# EAGLE design piston_slave (EAGLE 9.5.1)
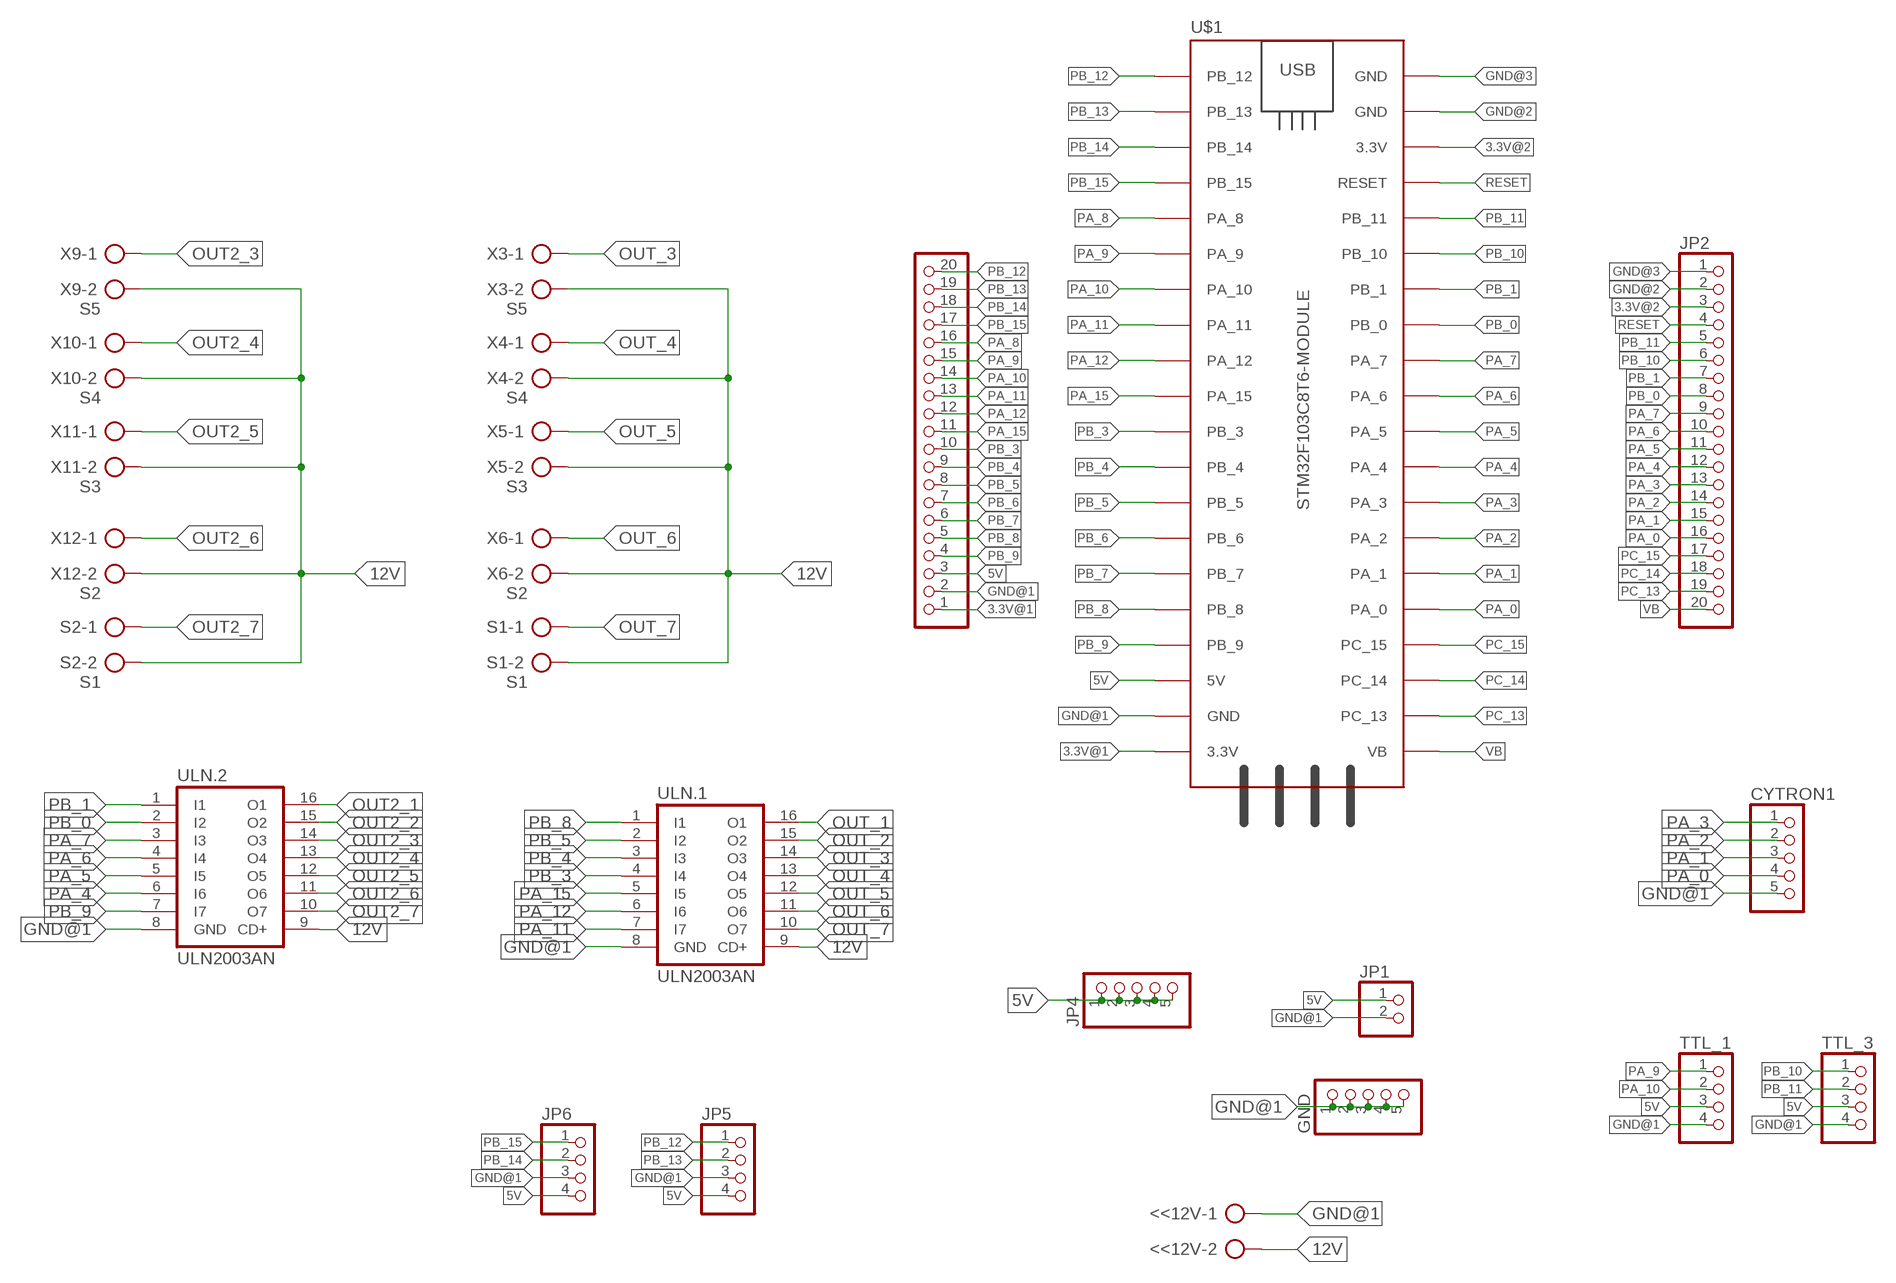
[diagram p0: schematic, sheet 1]

## Parts
<<12V  AK300/2  [AK300/2]
CYTRON1  PINHD-5_DATA  [DATA_5]
GND  PINHD-1X5  [1X05]
JP1  PINHD-2_DATA  [1X02_DATA]
JP2  PINHD-1X20  [1X20]
JP3  PINHD-1X20  [1X20]
JP4  PINHD-1X5  [1X05]
JP5  PINHD-4_DATA  [1X04_DATA]
JP6  PINHD-4_DATA  [1X04_DATA]
S1  S1  AK300/2  [AK300/2]
S2  S1  AK300/2  [AK300/2]
TTL_1  PINHD-4_DATA  [1X04_DATA]
TTL_3  PINHD-4_DATA  [1X04_DATA]
U$1  STM32F103C8T6-MODULE  [STM32F103C8T6-MODULE]
ULN.1  ULN2003AN  [DIL16]
ULN.2  ULN2003AN  [DIL16]
X3  S5  AK300/2  [AK300/2]
X4  S4  AK300/2  [AK300/2]
X5  S3  AK300/2  [AK300/2]
X6  S2  AK300/2  [AK300/2]
X9  S5  AK300/2  [AK300/2]
X10  S4  AK300/2  [AK300/2]
X11  S3  AK300/2  [AK300/2]
X12  S2  AK300/2  [AK300/2]

## Nets
3.3V@1: JP3.1 U$1.3.3V_1(3.3V)
3.3V@2: JP2.3 U$1.3.3V_2(3.3V)
5V: JP1.1 JP3.3 JP4.1 JP4.2 JP4.3 JP4.4 JP4.5 JP5.4 JP6.4 TTL_1.3 TTL_3.3 U$1.5V
12V: <<12V.2 S1.2 S2.2 ULN.1.9(CD+) ULN.2.9(CD+) X3.2 X4.2 X5.2 X6.2 X9.2 X10.2 X11.2 X12.2
GND@1: <<12V.1 CYTRON1.5 GND.1 GND.2 GND.3 GND.4 GND.5 JP1.2 JP3.2 JP5.3 JP6.3 TTL_1.4 TTL_3.4 U$1.GND_1(GND) ULN.1.8(GND) ULN.2.8(GND)
GND@2: JP2.2 U$1.GND_2(GND)
GND@3: JP2.1 U$1.GND_3(GND)
OUT2_1: ULN.2.16(O1)
OUT2_2: ULN.2.15(O2)
OUT2_3: ULN.2.14(O3) X9.1
OUT2_4: ULN.2.13(O4) X10.1
OUT2_5: ULN.2.12(O5) X11.1
OUT2_6: ULN.2.11(O6) X12.1
OUT2_7: S2.1 ULN.2.10(O7)
OUT_1: ULN.1.16(O1)
OUT_2: ULN.1.15(O2)
OUT_3: ULN.1.14(O3) X3.1
OUT_4: ULN.1.13(O4) X4.1
OUT_5: ULN.1.12(O5) X5.1
OUT_6: ULN.1.11(O6) X6.1
OUT_7: S1.1 ULN.1.10(O7)
PA_0: CYTRON1.4 JP2.16 U$1.PA_0
PA_1: CYTRON1.3 JP2.15 U$1.PA_1
PA_2: CYTRON1.2 JP2.14 U$1.PA_2
PA_3: CYTRON1.1 JP2.13 U$1.PA_3
PA_4: JP2.12 U$1.PA_4 ULN.2.6(I6)
PA_5: JP2.11 U$1.PA_5 ULN.2.5(I5)
PA_6: JP2.10 U$1.PA_6 ULN.2.4(I4)
PA_7: JP2.9 U$1.PA_7 ULN.2.3(I3)
PA_8: JP3.16 U$1.PA_8
PA_9: JP3.15 TTL_1.1 U$1.PA_9
PA_10: JP3.14 TTL_1.2 U$1.PA_10
PA_11: JP3.13 U$1.PA_11 ULN.1.7(I7)
PA_12: JP3.12 U$1.PA_12 ULN.1.6(I6)
PA_15: JP3.11 U$1.PA_15 ULN.1.5(I5)
PB_0: JP2.8 U$1.PB_0 ULN.2.2(I2)
PB_1: JP2.7 U$1.PB_1 ULN.2.1(I1)
PB_3: JP3.10 U$1.PB_3 ULN.1.4(I4)
PB_4: JP3.9 U$1.PB_4 ULN.1.3(I3)
PB_5: JP3.8 U$1.PB_5 ULN.1.2(I2)
PB_6: JP3.7 U$1.PB_6
PB_7: JP3.6 U$1.PB_7
PB_8: JP3.5 U$1.PB_8 ULN.1.1(I1)
PB_9: JP3.4 U$1.PB_9 ULN.2.7(I7)
PB_10: JP2.6 TTL_3.1 U$1.PB_10
PB_11: JP2.5 TTL_3.2 U$1.PB_11
PB_12: JP3.20 JP5.1 U$1.PB_12
PB_13: JP3.19 JP5.2 U$1.PB_13
PB_14: JP3.18 JP6.2 U$1.PB_14
PB_15: JP3.17 JP6.1 U$1.PB_15
PC_13: JP2.19 U$1.PC_13
PC_14: JP2.18 U$1.PC_14
PC_15: JP2.17 U$1.PC_15
RESET: JP2.4 U$1.RESET
VB: JP2.20 U$1.VB

## Library data of the parts
<<12V S1 S2 X3-X6 X9-X12 = con-ptr500:AK300/2: CONNECTOR; OC_FARNELL: unknown; OC_NEWARK: unknown
CYTRON1 = MIA_LIBRARY:PINHD-5_DATA: PIN HEADER
GND JP4 = MIA_LIBRARY:PINHD-1X5: PIN HEADER
JP1 = MIA_LIBRARY-2-2-2:PINHD-2_DATA: PIN HEADER
JP2 JP3 = pinhead:PINHD-1X20: PIN HEADER
JP5 JP6 TTL_1 TTL_3 = MIA_LIBRARY-2-2-2:PINHD-4_DATA: PIN HEADER
U$1 = MIA_LIBRARY:STM32F103C8T6-MODULE: STM32F103C8T6 module with ARM Cortex-3, 20kB SRAM, 64kB Flash, 72MHz
ULN.1 ULN.2 = MIA_LIBRARY:ULN2003A: DRIVER ARRAY

## Board
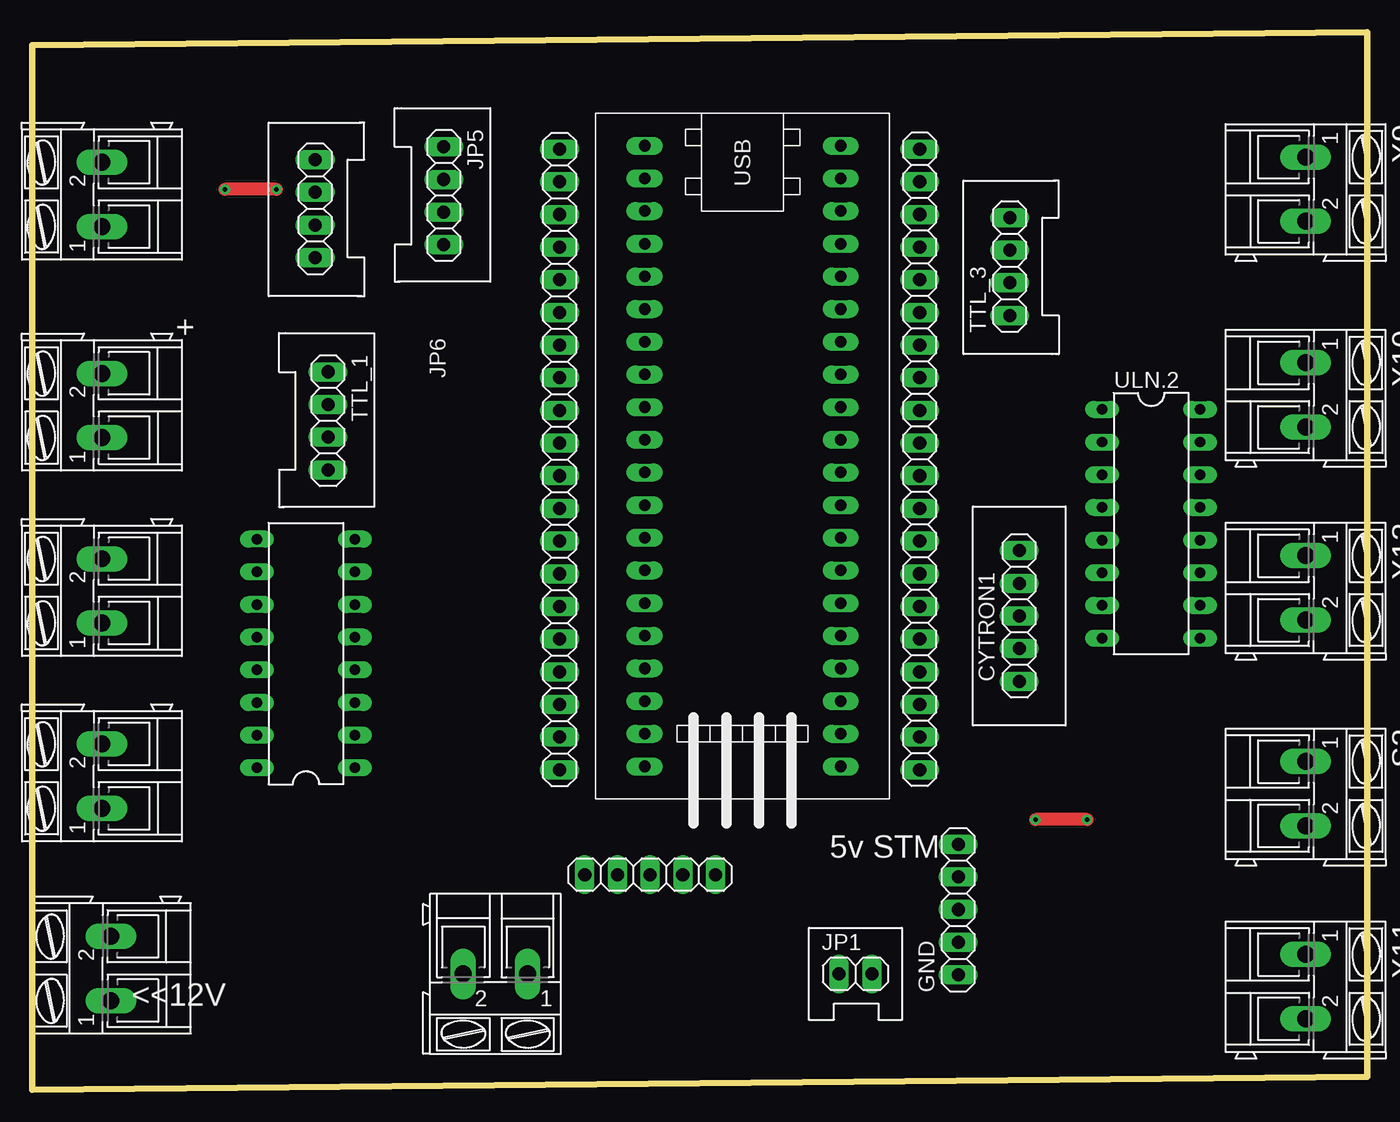
[diagram p1: board, top side]
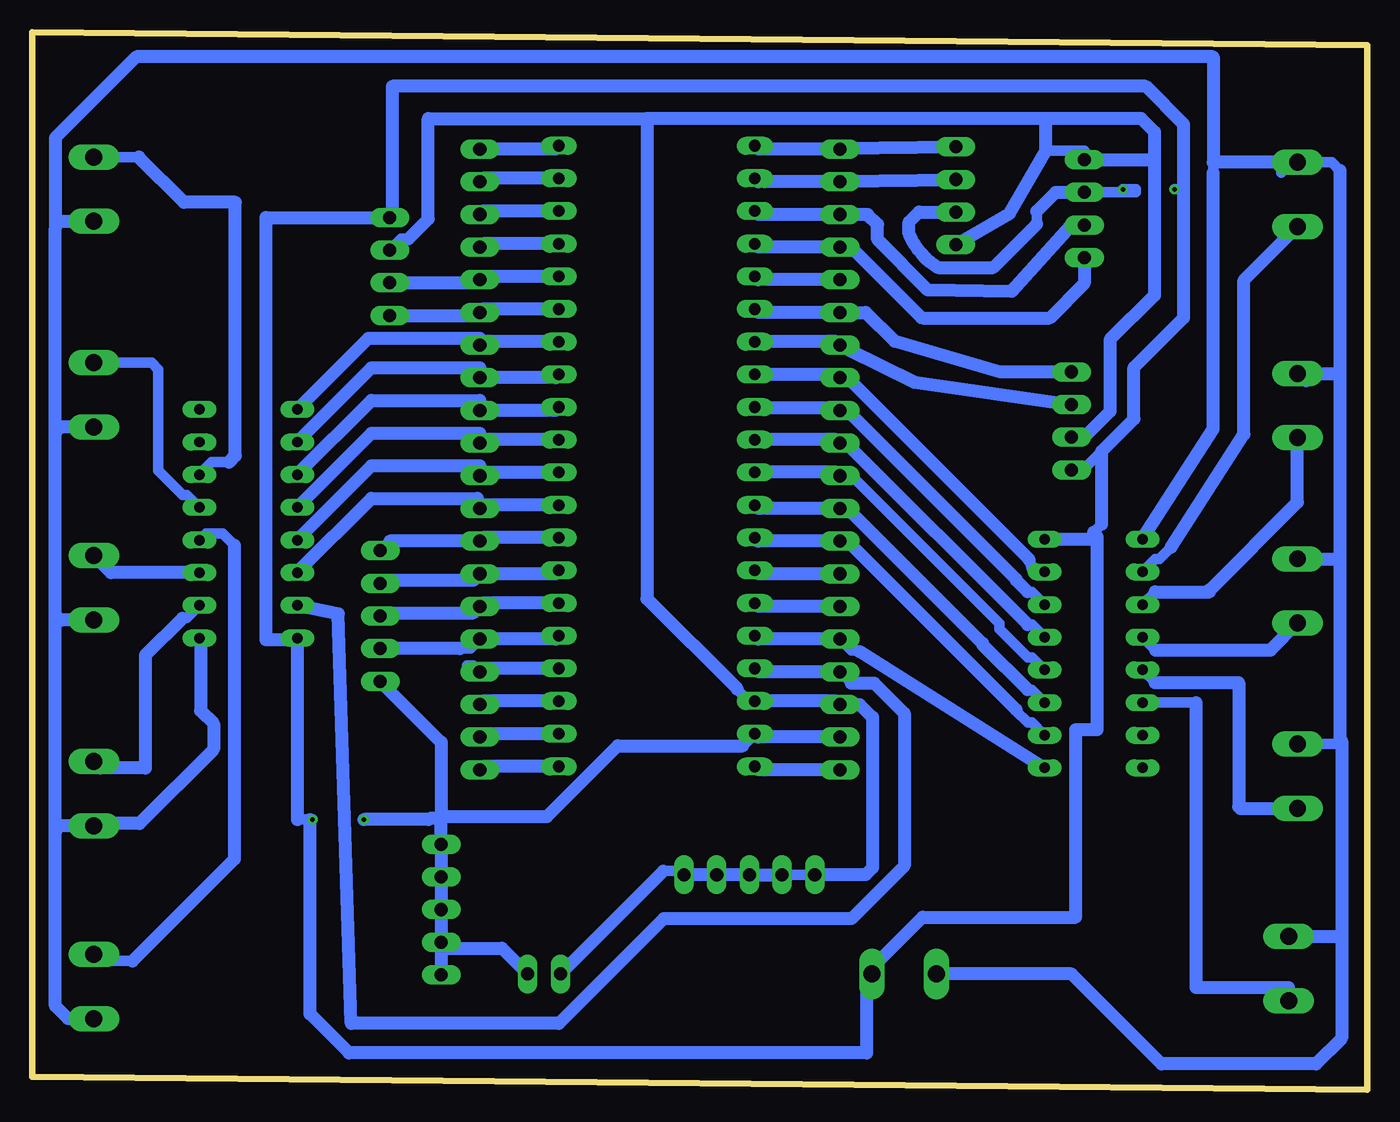
[diagram p2: board, bottom side, seen from below]

Size 103.8 x 82.22 mm. Coordinates in mm from the lower left corner, seen from the top.
Outline: 0,0 103.8,1 103.8,82.22 0,81.22 0,0
Copper layers (1*16): Top 0.035mm / dielectric 1.5mm / Bottom 0.035mm
Design rules "default *": minimum track width 0.8mm, minimum drill 0.35mm, track to track 0.5mm, track to pad 0.5mm, pad to pad 0.5mm, via to via 6mil, smd to smd 6mil, copper to edge 0.5mm, drill to drill 6mil, minimum pad ring 10mil, minimum via ring 8mil, stop-mask expansion 4mil, vias tented up to drill 0mil, thermal gap 10mil

### Footprints (pad centres in the part's own frame; a part is rotated, then mirrored left to right if it is on the bottom)
AK300/2 = drill 1.321 long: 1 -2.515,0; 2 2.489,0
DATA_5 = drill 1.016 long: 1 -5.08,0; 2 -2.54,0; 3 0,0; 4 2.54,0; 5 5.08,0
1X05 = drill 1.016 long: 1 -5.08,0; 2 -2.54,0; 3 0,0; 4 2.54,0; 5 5.08,0
1X02_DATA = drill 1.016 long: 1 -1.27,0; 2 1.27,0
1X20 = drill 1.016 long: 1 -24.13,0; 2 -21.59,0; 3 -19.05,0; 4 -16.51,0; 5 -13.97,0; 6 -11.43,0; 7 -8.89,0; 8 -6.35,0; 9 -3.81,0; 10 -1.27,0; 11 1.27,0; 12 3.81,0; 13 6.35,0; 14 8.89,0; 15 11.43,0; 16 13.97,0; 17 16.51,0; 18 19.05,0; 19 21.59,0; 20 24.13,0
1X04_DATA = drill 1.016 long: 1 -3.81,0; 2 -1.27,0; 3 1.27,0; 4 3.81,0
STM32F103C8T6-MODULE = drill 0.9 long: 3.3V_1 25.4,-7.62; 3.3V_2 -17.78,7.62; 5V 20.32,-7.62; GND_1 22.86,-7.62; GND_2 -20.32,7.62; GND_3 -22.86,7.62; PA_0 15.24,7.62; PA_1 12.7,7.62; PA_2 10.16,7.62; PA_3 7.62,7.62; PA_4 5.08,7.62; PA_5 2.54,7.62; PA_6 0,7.62; PA_7 -2.54,7.62; PA_8 -12.7,-7.62; PA_9 -10.16,-7.62; PA_10 -7.62,-7.62; PA_11 -5.08,-7.62; PA_12 -2.54,-7.62; PA_15 0,-7.62; PB_0 -5.08,7.62; PB_1 -7.62,7.62; PB_3 2.54,-7.62; PB_4 5.08,-7.62; PB_5 7.62,-7.62; PB_6 10.16,-7.62; PB_7 12.7,-7.62; PB_8 15.24,-7.62; PB_9 17.78,-7.62; PB_10 -10.16,7.62; PB_11 -12.7,7.62; PB_12 -22.86,-7.62; PB_13 -20.32,-7.62; PB_14 -17.78,-7.62; PB_15 -15.24,-7.62; PC_13 22.86,7.62; PC_14 20.32,7.62; PC_15 17.78,7.62; RESET -15.24,7.62; VB 25.4,7.62
DIL16 = drill 0.813 long: 1 -8.89,-3.81; 2 -6.35,-3.81; 3 -3.81,-3.81; 4 -1.27,-3.81; 5 1.27,-3.81; 6 3.81,-3.81; 7 6.35,-3.81; 8 8.89,-3.81; 9 8.89,3.81; 10 6.35,3.81; 11 3.81,3.81; 12 1.27,3.81; 13 -1.27,3.81; 14 -3.81,3.81; 15 -6.35,3.81; 16 -8.89,3.81

### Placement (x,y rotation side)
<<12V  36,9 180 top
CYTRON1  76.74,36.83 270 top
GND  72,14 90 top
JP1  64,9 0 top
JP2  69,49 270 top
JP3  41,49 90 top
JP4  48.04,16.71 180 top
JP5  32,69.5 270 top
JP6  22,68.5 90 top
S1  5.43,69.61 90 top
S2  99,23 270 top
TTL_1  23,52 270 top
TTL_3  76,64 90 top
U$1  55.23,50.53 270 top
ULN.1  21.29,33.91 90 top
ULN.2  87,44 270 top
X3  6.11,9.43 90 top
X4  5.43,24.38 90 top
X5  5.43,38.79 90 top
X6  5.43,53.2 90 top
X9  99,70 270 top
X10  99,54 270 top
X11  99,8 270 top
X12  99,39 270 top

### Tracks (layer width: path | path; a pad name or v marks a point on that pad's centre or on a via)
3.3V@1
  Bottom 0.8: 47.35,24.87 U$1.3.3V_1
  Bottom 1.016: JP3.1 47.35,24.87
3.3V@2
  Bottom 0.8: 68.74,68.31 JP2.3
  Bottom 1.016: U$1.3.3V_2 68.74,68.31
5V
  Bottom 0.8: JP3.3 41.26,30.21 | JP4.5 JP4.4 | TTL_3.3 75.12,66.15 74.55,66.15 | 48.98,31.15 49.05,31.15 48.11,30.21 U$1.5V | 54.73,17 53.12,17 JP4.1 | TTL_1.3 22,50.73 | 25,73 22,73 JP6.4
  Bottom 1.016: 41.26,30.21 U$1.5V | JP4.4 JP4.3 JP4.2 JP4.1 | 74.55,66.15 73,67.7 73,75.5 56,75.5 | 56,75.5 56,38.17 48.98,31.15 | JP1.1 54.73,17 | 25,75.5 17.58,75.5 16.54,74.46 16.54,72.31 | 25,75.5 56,75.5 | 22,50.73 20,52.73 20,58.3 16.54,61.76 16.54,72.31 | JP6.4 16.54,72.31 | JP5.4 27.82,68.12 25,73 25,75.5 | JP3.3 39.47,29.95 38.47,28.95 38.47,17.25 39,16.71 JP4.5
12V
  Bottom 0.8: 4.74,55 X6.2 | S1.2 5.61,72.1 | S1.2 2.77,72.1 2.13,71.46 | 2.08,11.92 2,12 | X4.2 2.26,26.87 2.13,27 2,27.13 | 2.41,41.28 2.13,41 | 2.44,55.69 2.13,56 | 102,67 101.49,67.51 | 101.49,51.51 102,51 | 101.51,36.51 102,37 | 101.49,20.51 102,20 | ULN.2.9 90.7,35 | 98.81,20.7 S2.2 | S1.2 5.9,72.1 6.71,71.29 | 17.68,43 ULN.1.9 | 12,71.29 11.98,71.29 11.98,72.1
  Bottom 1.016: 2.13,71.46 2.13,56 2.13,41 2.13,27 | 2,27.13 2,12 2,4 4,2 16,2 23,9 <<12V.2 | X3.2 2.08,11.92 | X5.2 2.41,41.28 | X6.2 2.44,55.69 | X11.2 101,5.51 102,6.51 102,20 102,37 102,51 102,67 102,74 95.7,80.3 11.98,80.3 11.98,72.1 S1.2 | 101.49,67.51 X9.2 | X10.2 101.49,51.51 | X12.2 101.51,36.51 | S2.2 101.49,20.51 | 90.7,35 90.7,29.46 89.7,28.46 89.7,26.46 95.46,20.7 98.81,20.7 | 11.98,71.29 11.98,51.36 ULN.1.9
GND@1  (via drill 0.35)
  Top 1.016: v82,21 v78,21 | v19,70 v15,70
  Bottom 0.8: 47.35,27.41 U$1.GND_1 48.55,26.73 | 75.8,68.01 TTL_3.4 | 71.54,11 GND.2 | ULN.2.8 83.31,34.99 | 83.19,21 82.19,21 v82,21 | 38.93,8.58 <<12V.1 38.52,9.48 | 72,21 73,21 72.79,21.21 72,21.21 | TTL_1.4 22.11,48.19 20.65,49.65 | 25.7,67.3 25.7,68.3 | JP6.3 18,69.77 18,70 v19,70 | v15,70 14.28,70 | 21.48,42.8 21.28,43 | 21.28,43.34 20.65,43.97
  Bottom 1.016: JP3.2 47.35,27.41 | 48.55,26.73 58.27,26.73 63.8,21.21 72,21.21 72,27.01 CYTRON1.5 | 75.8,68.01 75.8,78 17.24,78 14.28,75.04 14.28,70 14.28,60.02 18.15,56.15 18.15,52.15 20.65,49.65 20.65,43.97 | JP1.2 67.27,11 71.54,11 | GND.1 GND.2 GND.3 GND.4 GND.5 72,21 | 83.31,34.99 85.61,34.99 85.61,67.81 TTL_3.4 | ULN.2.8 83.19,21 | 82.19,21 82.19,5.88 79.17,2.86 38.93,2.86 38.93,8.58 | 73,21 v78,21 | 25.7,67.3 29.07,63.93 33.39,63.93 33.63,64.09 arc34 35.63,66.52 35.63,67.45 34.85,68.23 JP5.3 | 25.7,68.3 24.23,69.77 JP6.3 | 38.52,9.48 34.59,13.41 22.68,13.41 22.68,28 21,28 21,43 | ULN.1.8 21.48,42.8 | 21.28,43 21.28,43.34
GND@2
  Bottom 0.8: 68.74,70.85 JP2.2
  Bottom 1.016: U$1.GND_2 68.74,70.85
GND@3
  Bottom 0.8: U$1.GND_3 63.11,73.13
  Bottom 1.016: 63.11,73.13 JP2.1
OUT2_3
  Bottom 0.8: 95.52,72.52 X9.1 | ULN.2.14 89.83,48.79 88.5,48.79
  Bottom 1.016: 95.52,72.52 92,69 88,69 88,49.29 88.5,48.79
OUT2_4
  Bottom 0.8: 97.52,56.52 X10.1 94.52,56.52 94,56 94,48.13 92.12,46.25 91.79,46.25 ULN.2.13
OUT2_5
  Bottom 0.8: 88.09,42.34 89,43.25 90.29,43.25 ULN.2.12 | 96,10 98.48,10 X11.1
  Bottom 1.016: 88.09,42.34 88.09,17.91 96,10
OUT2_6
  Bottom 1.016: ULN.2.11 97.67,40.19 X12.1
OUT2_7
  Bottom 0.8: ULN.2.10 91.79,36.67 92.12,36.67 | 98.48,25 S2.1
  Bottom 1.016: 92.12,36.67 95,33.79 95,25 98.48,25
OUT_3
  Bottom 0.8: 13.3,30.1 ULN.1.14
  Bottom 1.016: X3.1 6.11,7.93 13.3,7.93 13.3,30.1
OUT_4
  Bottom 0.8: ULN.1.13 16.5,31.66 | 10,22 9.86,21.86
  Bottom 1.016: 16.5,31.66 10,31.66 10,22 | 9.86,21.86 X4.1
OUT_5
  Bottom 0.8: ULN.1.12 16.48,34.18
  Bottom 1.016: 16.48,34.18 7.52,34.18 X5.1
OUT_6
  Bottom 0.8: ULN.1.11 16.5,38.7 | 12.26,38.7 12.26,38.85
  Bottom 1.016: 16.5,38.7 12.26,38.7 | 12.26,38.85 5.43,45.69 X6.1
OUT_7
  Bottom 0.8: 15.26,42.15 16.17,41.24 16.5,41.24 ULN.1.10
  Bottom 1.016: 15.26,42.15 9.59,50.97 9.59,62.93 S1.1
PA_0
  Bottom 0.8: U$1.PA_0 63.11,35.03 | JP2.16 69.73,34.3 70.54,34.3 70.55,34.29
  Bottom 1.016: 63.11,35.03 JP2.16 | 70.55,34.29 CYTRON1.4
PA_1
  Bottom 0.8: 69.5,37.07 JP2.15 68.74,37.83 | CYTRON1.3 76.24,36.83 76,37.07
  Bottom 1.016: 76,37.07 69.5,37.07 | U$1.PA_1 68.74,37.83
PA_2
  Bottom 0.8: U$1.PA_2 63.11,40.11 | JP2.14 69.5,39.61 | CYTRON1.2 76.24,39.37 76,39.61
  Bottom 1.016: 63.11,40.11 JP2.14 | 76,39.61 69.5,39.61
PA_3
  Bottom 0.8: 68.74,42.91 JP2.13 | 76,42.65 CYTRON1.1
  Bottom 1.016: U$1.PA_3 68.74,42.91 | JP2.13 76,42.65
PA_4
  Bottom 0.8: 69.55,45.45 70,45 69.19,45 | 69.19,45 JP2.12 | 69.19,45.97 69.19,45
  Bottom 1.016: U$1.PA_4 69.55,45.45 | ULN.2.6 77.41,45.97 69.19,45.97
PA_5
  Bottom 0.8: 68.74,47.99 JP2.11 69,48.51
  Bottom 1.016: U$1.PA_5 68.74,47.99 | ULN.2.5 77.41,48.51 69,48.51
PA_6
  Bottom 0.8: 68.74,50.53 JP2.10 69,51.05
  Bottom 1.016: U$1.PA_6 68.74,50.53 | ULN.2.4 77.41,51.05 69,51.05
PA_7
  Bottom 0.8: U$1.PA_7 63.11,52.81 | 69,53.59 JP2.9
  Bottom 1.016: 63.11,52.81 JP2.9 | ULN.2.3 77.41,53.59 69,53.59
PA_8
  Bottom 0.8: 47.35,62.97 U$1.PA_8
  Bottom 1.016: JP3.16 47.35,62.97
PA_9
  Bottom 0.8: 47.35,60.43 U$1.PA_9
  Bottom 1.016: 47.35,60.43 JP3.15 39,60.43 36.76,58.19 28.55,55.81 TTL_1.1
PA_10
  Bottom 0.8: JP3.14 41.26,58.15 | 40.43,57.89 JP3.14 | 39.99,57.89 JP3.14
  Bottom 1.016: 41.26,58.15 U$1.PA_10 | JP3.14 40.33,57.55 35.22,55 TTL_1.2
PA_11
  Bottom 0.8: 41,55.61 JP3.13 40.43,55.35 | 26.28,41.21 26.01,40.26 ULN.1.7
  Bottom 1.016: 41,55.61 U$1.PA_11 | 40.43,55.35 26.28,41.21
PA_12
  Bottom 0.8: 41.19,53 JP3.12 40.88,52.93 40.55,52.93 | 48,53 47.93,53.07 U$1.PA_12 | 26.41,38.7 26.08,38.7 ULN.1.6 | 27.32,39.7 27.32,39.61
  Bottom 1: 27.32,39.61 26.41,38.7
  Bottom 1.016: 41.19,53 48,53 | 40.55,52.93 27.32,39.7
PA_15
  Bottom 0.8: 41.26,50.53 JP3.11 40.88,50.39 40.64,50.39 | 26.41,36.16 26.08,36.16 ULN.1.5
  Bottom 1.016: 41.26,50.53 U$1.PA_15 | 40.64,50.39 26.41,36.16
PB_0
  Bottom 0.8: U$1.PB_0 63.11,55.35 | 69,56.13 JP2.8
  Bottom 1.016: 63.11,55.35 JP2.8 | ULN.2.2 77.41,56.13 69,56.13
PB_1
  Bottom 0.8: 68.74,58.15 JP2.7 69,58.43
  Bottom 1.016: U$1.PB_1 68.74,58.15 | ULN.2.1 77.65,58.43 69,58.43
PB_3
  Bottom 0.8: 41.27,48 JP3.10 40.11,47.73 28.62,36.24 28.62,35.83 26.41,33.62 26.08,33.62 ULN.1.4 | 48,48 47,48 47.01,47.99 U$1.PB_3
  Bottom 1.016: 41.27,48 47,48
PB_4
  Bottom 0.8: 47.35,45.19 U$1.PB_4 | 26.41,31.08 26.08,31.08 ULN.1.3
  Bottom 1: JP3.9 40.88,45.31 40.53,45.31
  Bottom 1.016: JP3.9 47.35,45.19 | 26.41,31.08 29.92,34.59 29.92,34.7 40.53,45.31
PB_5
  Bottom 0.8: 47.35,42.65 U$1.PB_5 | JP3.8 41.12,42.77 40.55,42.77 | ULN.1.2 26.08,28.54 26.41,28.54 27.32,29.45 27.32,29.54
  Bottom 1.016: JP3.8 47.35,42.65 | 40.55,42.77 27.32,29.54
PB_6
  Bottom 0.8: 47.35,40.11 U$1.PB_6
  Bottom 1.016: JP3.7 47.35,40.11
PB_7
  Bottom 0.8: 47.35,37.57 U$1.PB_7
  Bottom 1.016: JP3.6 47.35,37.57
PB_8
  Bottom 0.8: 47.35,35.03 U$1.PB_8 | 39.45,34.06 39.55,34.15 40.12,34.15 JP3.5
  Bottom 1.016: JP3.5 47.35,35.03 | 39.45,34.06 ULN.1.1
PB_9
  Bottom 0.8: 47.35,32.49 U$1.PB_9 | JP3.4 40.12,31.61
  Bottom 1.016: JP3.4 47.35,32.49 | 40.12,31.61 38.36,31.61 36,29.26 36,17.41 40.12,13.29 54.71,13.29 62.84,5.16 79,5.16 80,37 ULN.2.7
PB_10
  Bottom 0.8: 68.74,60.69 JP2.6 69.24,60.19
  Bottom 1.016: U$1.PB_10 68.74,60.69 | TTL_3.1 69.24,60.19
PB_11
  Bottom 0.8: 68.74,63.23 JP2.5 69.24,62.73
  Bottom 1.016: U$1.PB_11 68.74,63.23 | TTL_3.2 69.24,62.73
PB_12
  Bottom 0.8: 47.35,73.13 U$1.PB_12 | 40.94,73.19 JP3.20
  Bottom 1.016: JP3.20 47.35,73.13 | 40.94,73.19 JP5.1
PB_13
  Bottom 0.8: 47.35,70.59 U$1.PB_13 | 40.94,70.65 JP3.19
  Bottom 1.016: JP3.19 47.35,70.59 | 40.94,70.65 JP5.2
PB_14
  Bottom 0.8: 47.35,68.05 U$1.PB_14 | JP6.2 23,67.23
  Bottom 1.016: 47.35,68.05 JP3.18 38.85,68.05 38.07,67.27 38.07,66.11 34.2,62.17 27.67,62.06 23,67.23
PB_15
  Bottom 0.8: 47.35,65.51 U$1.PB_15 | 40.37,65.73 41,65.73 JP3.17
  Bottom 1.016: JP3.17 47.35,65.51 | 40.37,65.73 34.68,60.04 34.59,60 24.69,60 22,62.69 JP6.1
PC_13
  Bottom 0.8: 68.74,27.67 JP2.19
  Bottom 1.016: U$1.PC_13 68.74,27.67
PC_14
  Bottom 0.8: 68.74,30.21 JP2.18
  Bottom 1.016: U$1.PC_14 68.74,30.21
PC_15
  Bottom 0.8: 69.75,32.75 70,33 69.51,33 JP2.17
  Bottom 1.016: U$1.PC_15 69.75,32.75
RESET
  Bottom 0.8: 68.74,65.77 JP2.4
  Bottom 1.016: U$1.RESET 68.74,65.77
VB
  Bottom 0.8: 68.74,25.13 JP2.20
  Bottom 1.016: U$1.VB 68.74,25.13

### Text on the board
tPlace: - | +
tNames: 5v STM